# Altium schematic sheet Relay.SchDoc: LOAD SWITCH & SENSE
size A4; SheetNumber: 6; SheetTotal: 7; DOC_NO_SCH_DWG: #022024031505
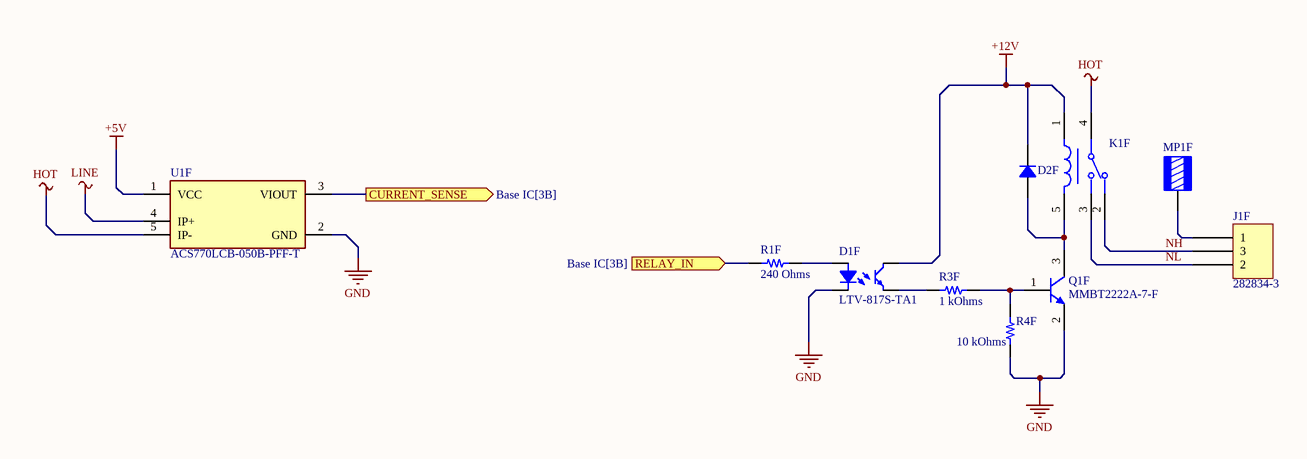
[diagram p0: Relay.SchDoc]

## Parts
D1F  LTV-817S-TA1  [LITEON LTV-817]
D2F  S2A-13-F  [DO214AA SMB]  (value not drawn)
J1F  282834-3  [TE 282834-3]
K1F  G2R-1-DC12  [FP-G2R-1-DC12-MFG]  (value not drawn)
MP1F  74650173R  [WURTH 74650173]  (value not drawn)
Q1F  MMBT2222A-7-F  [DIODES SOT-23-3]
R1F  240 Ohms  [RES 0603_1608]
R3F  1 kOhms  [RES 0603_1608]
R4F  10 kOhms  [RES 0603_1608]
U1F  ACS770LCB-050B-PFF-T  [FP-CB-5-PFF-MFG]

## Ports
CURRENT_SENSE (out, see Base IC[3B]), RELAY_IN (in, see Base IC[3B])

## Nets
+5V: U1F.1(VCC)
+12V: D1F.4 D2F.2 K1F.1
GND: D1F.2 Q1F.2(E) R4F.1 U1F.2(GND)
HOT: K1F.4 U1F.5(IP-)
LINE: U1F.4(IP+)
CURRENT_SENSE: U1F.3(VIOUT) ; port CURRENT_SENSE
NH: J1F.3 K1F.2
NL: J1F.2 K1F.3
RELAY_IN: R1F.1 ; port RELAY_IN
NetD1F_1: D1F.1 R1F.2
NetD1F_3: D1F.3 R3F.1
NetD2F_1: D2F.1 K1F.5 Q1F.3(C)
NetJ1F_1: J1F.1 MP1F.1
NetQ1F_1: Q1F.1(B) R3F.2 R4F.2

## Notes on the sheet
- THIS DOCUMENT AND THE DATA DISCLOSED HEREIN OR
- HEREWITH IS THE PROPERTY OF SPD Ind.
- ENG:
- DHARAGESWARAN S
- APPROVALS
- DATE
- PROJECT
- DSN:
- CHK:
- REFERENCE DOCUMENTS
- PROJECT REVISION:
- TITLE
- DOCUMENT REVISION:
- Email: sdhamuvkl@gmail.com <https://github.com/DhamuVkl>
- BOM:
- FAB DWG:
- PCB DWG:
- ASSY DWG:
- SCALE:
- A4
- SIZE
- CAGE CODE
- FILE NAME
- DWG NO.
- SHEET
- REV
- OF

## Library data of the parts
D1F = LTV-817S-TA1: OPTOISOLATR 5KV TRANSISTOR 4-SMD; Manufacturer: Lite-On Inc.; id: 2; Current Transfer Ratio (Max): 600% @ 5mA; Rise / Fall Time (Typ): 4µs, 3µs; Current - Dc Forward (If) (Max): 50mA; Input Type: DC; Voltage - Output (Max): 35V; Current Transfer Ratio (Min): 50% @ 5mA; Voltage - Forward (Vf) (Typ): 1.2V; Voltage - Isolation: 5000Vrms; Number Of Channels: 1; Vce Saturation (Max): 200mV; Part Number: LTV-817S-TA1; Supplier Part Number 1: 160-1893-1-ND; Output Type: Transistor; Supplier Device Package: 4-SMD; ComponentLink1Description: Datasheet; ComponentLink2URL: http://digikey.com/product-detail/en/lite-on-inc/LTV-817S-TA1/160-1893-1-ND/3306757; ComponentLink1URL: http://optoelectronics.liteon.com/upload/download/DS-70-96-0016/LTV-8X7%20series%20201610%20.pdf; Supplier 1: DigiKey; Series: -; Part Status: Active; ComponentLink2Description: DigiKey Link; Device Package: 4-SMD, Gull Wing; Packaging: TapeAndReel; Minimum Order: 1; Package / Case: 4-SMD, Gull Wing; Lifecycle Status: Active; LastUpdated: 2020-01-12T21:58:48.100; Operating Temperature: -30°C ~ 110°C; Mounting Type: Surface Mount; Current - Output / Channel: 50mA; Price: 0.12
D2F = S2A-13-F: DIODE GEN PURP 50V 1.5A SMB; Manufacturer: Diodes Incorporated; id: 302; Capacitance @ Vr, F: 20pF @ 4V, 1MHz; Speed: Standard Recovery >500ns, > 200mA (Io); Voltage - Forward (Vf) (Max) @ If: 1.15 V @ 1.5 A; Diode Type: Standard; Current - Reverse Leakage @ Vr: 5 µA @ 50 V; Part Number: S2A-13-F; Supplier Part Number 1: S2A-FDICT-ND; Supplier Device Package: SMB; ComponentLink1Description: Datasheet; ComponentLink2URL: https://www.digikey.com/en/products/detail/diodes-incorporated/S2A-13-F/814429; ComponentLink1URL: https://www.diodes.com/assets/Datasheets/ds16004.pdf; Supplier 1: DigiKey; Series: -; Part Status: Active; ComponentLink2Description: DigiKey Link; Current - Average Rectified (Io): 1.5A; Operating Temperature - Junction: -65°C ~ 150°C; Packaging: TapeAndReel; Minimum Order: 1; Voltage - DC Reverse (Vr) (Max): 50 V; Package / Case: DO-214AA, SMB; PartId: 302; Lifecycle Status: Active; LastUpdated: 2023-01-02T20:53:07.120; Mounting Type: Surface Mount; Price: 0.05
J1F = 282834-3: TERM BLK 3P SIDE ENT 2.54MM PCB; Manufacturer: TE Connectivity AMP Connectors; id: 2; Wire Gauge: 16-30 AWG; Voltage: 150V; Positions Per Level: 3; Number Of Levels: 1; Pitch: 0.100" (2.54mm); Mating Orientation: Horizontal with Board; Wire Termination: Screw - Rising Cage Clamp; Current: 10A; Part Number: 282834-3; Supplier Part Number 1: A98334-ND; ComponentLink1Description: Datasheet; Color: Green; ComponentLink2URL: http://digikey.com/product-detail/en/te-connectivity-amp-connectors/282834-3/A98334-ND/1153264; ComponentLink1URL: https://www.te.com/commerce/DocumentDelivery/DDEController?Action=srchrtrv&DocNm=282834&DocType=Customer+Drawing&DocLang=English; Supplier 1: DigiKey; Series: Buchanan; Part Status: Active; ComponentLink2Description: DigiKey Link; Packaging: Bulk; Minimum Order: 1; Lifecycle Status: Active; LastUpdated: 2020-01-15T04:15:50.317; Mounting Type: Through Hole; Price: 2.01
K1F = CMP-08822-000109-1: RELAY GEN PURPOSE SPDT 10A 12V; Power Rating: 530mW; Relay Type: General Purpose; Max Voltage Rating (DC): 125V; Coil Type: Non-Latching; Coil Resistance: 275R; Release Time: 5ms; Coil Current: 43.6mA; Operate Time: 15ms; Voltage Rating (AC): 380V; Weight: 17g; Min Operating Temperature: -40°C; Coil Power: 530mW; Contact Current Rating: 10A; Power Consumption: 530mW; Series: G2R; Lead Free: Lead Free; Mount: Through Hole; Height: 25.3mm; Contact Material: Silver; Number of Pins: 5; Max Operating Temperature: 70°C; Depth: 13mm; Termination: PC Pin; Max Current Rating: 10A; Length: 29mm; Width: 13mm; Throw Configuration: SPDT; Coil Voltage (DC): 12V; REACH SVHC: No SVHC; Packaging: Tray; Radiation Hardening: No; Package Quantity: 100; Max Voltage Rating (AC): 380V
MP1F = 74650173R: TERM REDCUBE M3 4PIN PCB; Manufacturer: Würth Elektronik; id: 4; Current Rating (Amps): 50 A; Part Number: 74650173R; Supplier Part Number 1: 732-10885-1-ND; Termination: Solder; Screw Size: M3; ComponentLink1Description: Datasheet; ComponentLink2URL: https://www.digikey.com/en/products/detail/würth-elektronik/74650173R/6643981; Features: Screw not Included; ComponentLink1URL: https://katalog.we-online.de/em/datasheet/74650173R.pdf; Supplier 1: DigiKey; Series: REDCUBE WP-THRBU; Part Status: Active; ComponentLink2Description: DigiKey Link; Number Of Pins: 4; Packaging: TapeAndReel; Minimum Order: 1; Lifecycle Status: Active; LastUpdated: 2022-08-07T20:42:53.530; Terminal Type: Screw Terminal, Power Tap; Mounting Type: Through Hole; Price: 2.63
Q1F = MMBT2222A-7-F: TRANS NPN 40V 0.6A SOT23-3; Manufacturer: Diodes Incorporated; id: 84; Current - Collector (Ic) (Max): 600 mA; Power - Max: 310 mW; DC Current Gain (Hfe) (Min) @ Ic, Vce: 100 @ 150mA, 10V; Current - Collector Cutoff (Max): 10nA (ICBO); Vce Saturation (Max) @ Ib, Ic: 1V @ 50mA, 500mA; Frequency - Transition: 300MHz; Part Number: MMBT2222A-7-F; Supplier Part Number 1: MMBT2222A-FDICT-ND; Supplier Device Package: SOT-23-3; ComponentLink1Description: Datasheet; ComponentLink2URL: https://www.digikey.com/en/products/detail/diodes-incorporated/MMBT2222A-7-F/814503; ComponentLink1URL: https://www.diodes.com/assets/Datasheets/ds30041.pdf; Supplier 1: DigiKey; Series: Automotive, AEC-Q101; Part Status: Active; ComponentLink2Description: DigiKey Link; Packaging: TapeAndReel; Minimum Order: 1; Transistor Type: NPN; Voltage - Collector Emitter Breakdown (Max): 40 V; Package / Case: TO-236-3, SC-59, SOT-23-3; PartId: 84; Lifecycle Status: Active; LastUpdated: 2023-01-02T21:11:05.533; Operating Temperature: -55°C ~ 150°C (TJ); Mounting Type: Surface Mount; Price: 0.02
R1F = RK73B1JTTD241J: RES 240 OHM 5% 1/8W 0603; Manufacturer: KOA Speer Electronics, Inc.; id: 492; Temperature Coefficient: ±200ppm/°C; Power (Watts): 0.125W, 1/8W; Part Number: RK73B1JTTD241J; Height - Seated (Max): 0.022" (0.55mm); Supplier Part Number 1: 2019-RK73B1JTTD241JCT-ND; Supplier Device Package: 0603; ComponentLink1Description: Datasheet; ComponentLink2URL: https://www.digikey.com/en/products/detail/koa-speer-electronics-inc/RK73B1JTTD241J/9844758; Features: Automotive AEC-Q200; ComponentLink1URL: http://www.koaspeer.com/catimages/Products/RK73B/RK73B.pdf; Composition: Thick Film; Tolerance: ±5%; Supplier 1: DigiKey; Series: RK73B; Part Status: Active; ComponentLink2Description: DigiKey Link; Device Package: 0603 (1608 Metric); Packaging: CutTape; Ratings: AEC-Q200; Minimum Order: 1; Package / Case: 0603 (1608 Metric); PartId: 5905; Lifecycle Status: Active; LastUpdated: 2023-01-02T20:30:22.853; Operating Temperature: -55°C ~ 155°C; Number Of Terminations: 2; Value: 240 Ohms; Size / Dimension: 0.063" L x 0.031" W (1.60mm x 0.80mm); Price: 0.01; Resistance: 240 Ohms
R3F = AT0603DRD071KL: RES SMD 1K OHM 0.5% 1/10W 0603; Manufacturer: Yageo; id: 26; Temperature Coefficient: ±25ppm/°C; Power (Watts): 0.1W, 1/10W; Part Number: AT0603DRD071KL; Height - Seated (Max): 0.022" (0.55mm); Supplier Part Number 1: YAG2115CT-ND; Supplier Device Package: 0603; ComponentLink1Description: Datasheet; ComponentLink2URL: https://www.digikey.com/en/products/detail/yageo/AT0603DRD071KL/5138634; Features: Anti-Sulfur, Automotive AEC-Q200, Moisture Resistant; ComponentLink1URL: http://www.yageo.com/documents/recent/PYu-AT_51_RoHS_L_5.pdf; Composition: Thin Film; Tolerance: ±0.5%; Supplier 1: DigiKey; Series: AT; Part Status: Active; ComponentLink2Description: DigiKey Link; Device Package: 0603 (1608 Metric); Packaging: TapeAndReel; Ratings: AEC-Q200; Minimum Order: 1; Package / Case: 0603 (1608 Metric); PartId: 4899; Lifecycle Status: Active; LastUpdated: 2023-01-02T20:30:26.797; Operating Temperature: -55°C ~ 155°C; Number Of Terminations: 2; Value: 1 kOhms; Size / Dimension: 0.063" L x 0.031" W (1.60mm x 0.80mm); Price: 0.02; Resistance: 1 kOhms
R4F = CPF0603B10KE: RES SMD 10K OHM 0.1% 1/16W 0603; Manufacturer: TE Connectivity Passive Product; id: 14; Temperature Coefficient: ±25ppm/°C; Power (Watts): 0.063W, 1/16W; Part Number: CPF0603B10KE; Height - Seated (Max): 0.022" (0.55mm); Supplier Part Number 1: A119886CT-ND; Supplier Device Package: 0603; ComponentLink1Description: Datasheet; ComponentLink2URL: https://www.digikey.com/en/products/detail/te-connectivity-passive-product/CPF0603B10KE/2389826; ComponentLink1URL: https://www.te.com/commerce/DocumentDelivery/DDEController?Action=srchrtrv&DocNm=1773200&DocType=DS&DocLang=English; Composition: Thin Film; Tolerance: ±0.1%; Supplier 1: DigiKey; Series: CPF, Neohm; Part Status: Active; ComponentLink2Description: DigiKey Link; Device Package: 0603 (1608 Metric); Packaging: TapeAndReel; Minimum Order: 1; Package / Case: 0603 (1608 Metric); PartId: 4872; Lifecycle Status: Active; LastUpdated: 2023-01-02T20:30:26.913; Operating Temperature: -55°C ~ 155°C; Number Of Terminations: 2; Value: 10 kOhms; Size / Dimension: 0.061" L x 0.031" W (1.55mm x 0.80mm); Price: 0.09; Resistance: 10 kOhms
U1F = CMP-82923-000004-3: SENSOR CURRENT HALL 50A AC/DC; Max Input Voltage: 5.5V; Polarity: Bidirectional; Accuracy: 0.6%; Response Time: 4.6us; Sensitivity: 40mV/A; Number of Channels: 1; Max Supply Current: 15mA; Linearity: 1%; Frequency: 120kHz; Min Input Voltage: 4.5V; Width: 13mm; Package Quantity: 34; Min Operating Temperature: -40°C; Height: 7mm; RoHS Compliant: Yes; Current Sensing: 50A; Mount: Through Hole; Length: 14mm; Packaging: Rail/Tube; Number of Pins: 5; Max Operating Temperature: 150°C